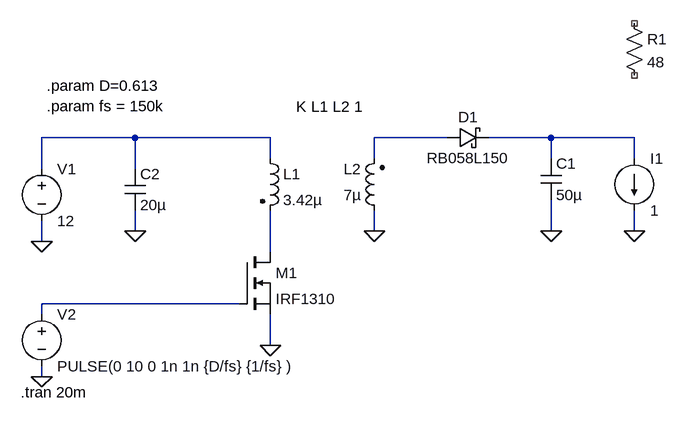
[diagram p0: schematic Flyback-DCM.asc]
Flyback-DCM.asc, the LTspice schematic file:
Version 4
SHEET 1 880 680
WIRE -32 64 -176 64
WIRE 176 64 -32 64
WIRE 448 64 336 64
WIRE 608 64 512 64
WIRE 736 64 608 64
WIRE 176 96 176 64
WIRE 336 96 336 64
WIRE 608 96 608 64
WIRE 736 96 736 64
WIRE -176 112 -176 64
WIRE -32 112 -32 64
WIRE -32 208 -32 176
WIRE 336 208 336 176
WIRE 608 208 608 160
WIRE 736 208 736 176
WIRE -176 224 -176 192
WIRE 176 240 176 176
WIRE 128 320 -176 320
WIRE -176 336 -176 320
WIRE 176 384 176 336
WIRE -176 432 -176 416
FLAG 176 384 0
FLAG -176 224 0
FLAG -176 432 0
FLAG -32 208 0
FLAG 336 208 0
FLAG 608 208 0
FLAG 736 208 0
SYMBOL ind2 160 80 R0
SYMATTR InstName L1
SYMATTR Value 3.42µ
SYMATTR Type ind
SYMBOL ind2 352 192 R180
WINDOW 0 36 80 Left 2
WINDOW 3 36 40 Left 2
SYMATTR InstName L2
SYMATTR Value 7µ
SYMATTR Type ind
SYMBOL schottky 448 80 R270
WINDOW 0 32 32 VTop 2
WINDOW 3 0 32 VBottom 2
SYMATTR InstName D1
SYMATTR Value RB058L150
SYMATTR Description Diode
SYMATTR Type diode
SYMBOL cap 592 96 R0
SYMATTR InstName C1
SYMATTR Value 50µ
SYMBOL nmos 128 240 R0
SYMATTR InstName M1
SYMATTR Value IRF1310
SYMBOL voltage -176 96 R0
WINDOW 123 0 0 Left 0
WINDOW 39 0 0 Left 0
SYMATTR InstName V1
SYMATTR Value 12
SYMBOL voltage -176 320 R0
WINDOW 123 0 0 Left 0
WINDOW 39 0 0 Left 0
SYMATTR InstName V2
SYMATTR Value PULSE(0 10 0 1n 1n {D/fs} {1/fs} )
SYMBOL res 720 -128 R0
SYMATTR InstName R1
SYMATTR Value 48
SYMBOL cap -48 112 R0
SYMATTR InstName C2
SYMATTR Value 20µ
SYMBOL current 736 96 R0
WINDOW 123 0 0 Left 0
WINDOW 39 0 0 Left 0
SYMATTR InstName I1
SYMATTR Value 1
TEXT -208 456 Left 2 !.tran 20m
TEXT 216 16 Left 2 !K L1 L2 1
TEXT -168 -16 Left 2 !.param D=0.613\n.param fs = 150k

The netlist it stands for:
* Flyback-DCM.asc
L1 N001 N004 3.42µ
L2 0 N002 7µ
D1 N002 N003 RB058L150
C1 N003 0 50µ
M1 N004 N005 0 0 IRF1310
V1 N001 0 12
V2 N005 0 PULSE(0 10 0 1n 1n {D/fs} {1/fs} )
R1 NC_01 NC_02 48
C2 N001 0 20µ
I1 N003 0 1
.model D D
.lib standard.dio
.model NMOS NMOS
.model PMOS PMOS
.lib standard.mos
.tran 20m
K L1 L2 1
.param D=0.613
.param fs = 150k
.backanno
.end